# EAGLE design sensor_board (EAGLE 5.11)
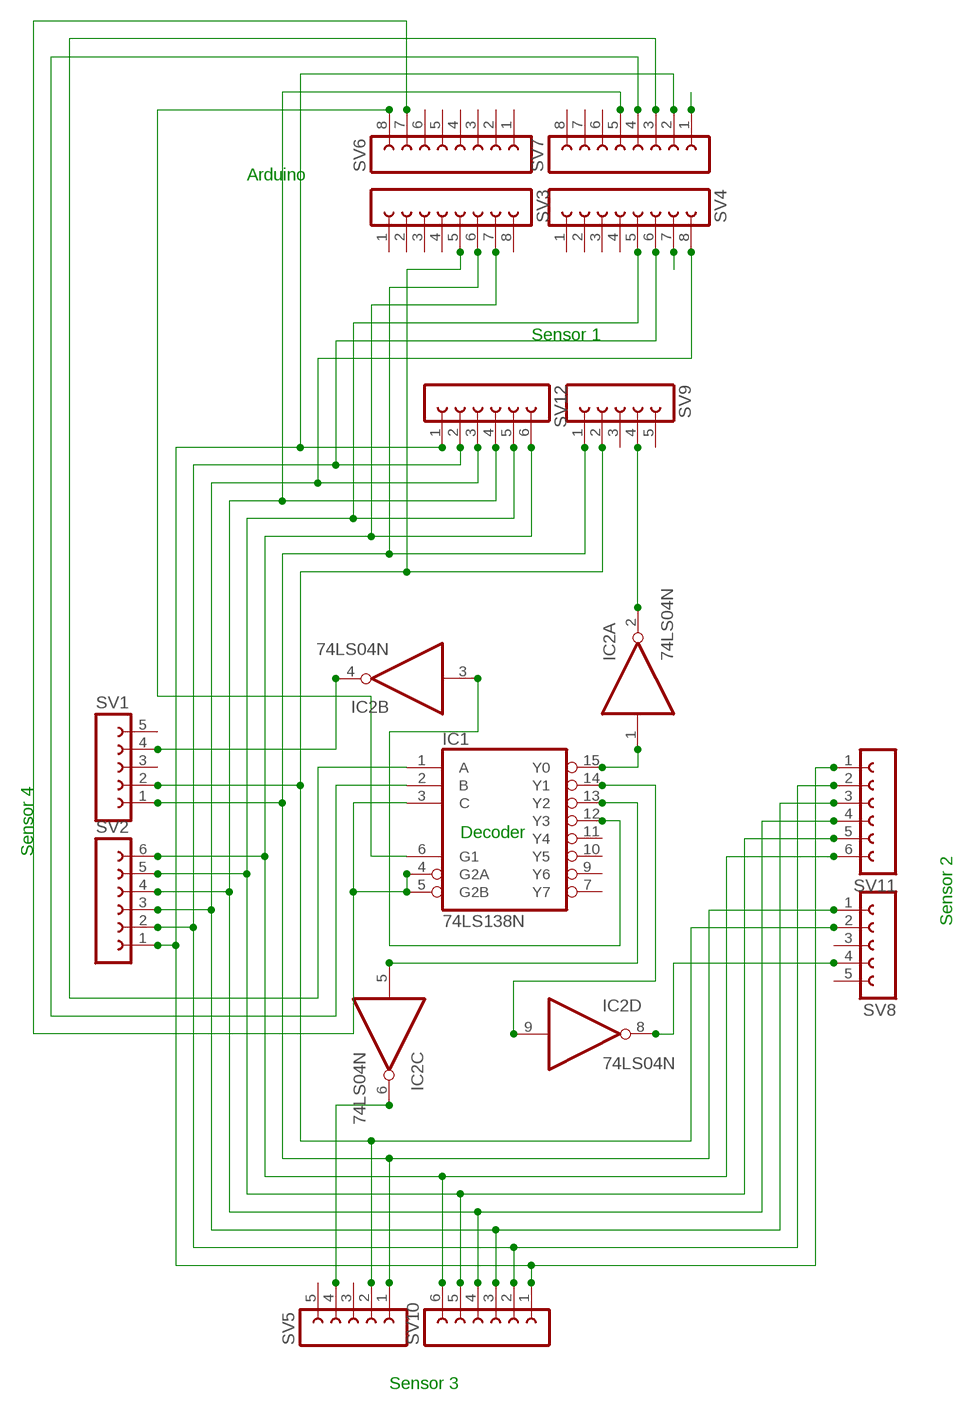
[diagram p0: schematic, sheet 1]

## Parts
IC1  74LS138N  [DIL16]
IC2  74LS04N  [DIL14]
SV1  FE05-1  [FE05-1]
SV2  FE06-1  [FE06]
SV3  FE08-1  [FE08]
SV4  FE08-1  [FE08]
SV5  FE05-1  [FE05-1]
SV6  FE08-1  [FE08]
SV7  FE08-1  [FE08]
SV8  FE05-1  [FE05-1]
SV9  FE05-1  [FE05-1]
SV10  FE06-1  [FE06]
SV11  FE06-1  [FE06]
SV12  FE06-1  [FE06]

## Nets
N$1: SV2.4 SV7.5 SV10.4 SV11.4 SV12.4
N$2: IC1.6(G1) SV6.8
N$9: IC2.4(B:O) SV1.4
N$10: IC2.6(C:O) SV5.4
N$11: IC2.8(D:O) SV8.4
N$12: IC2.2(A:O) SV9.4
N$13: IC1.15(Y0) IC2.1(A:I)
N$14: IC1.14(Y1) IC2.9(D:I)
N$15: IC1.13(Y2) IC2.5(C:I)
N$16: IC1.12(Y3) IC2.3(B:I)
N$17: IC1.3(C) IC1.4(G2A) IC1.5(G2B) SV6.7
N$19: IC1.2(B) SV7.4
N$20: SV1.2 SV3.5 SV5.2 SV8.2 SV9.2
N$21: SV1.1 SV3.6 SV5.1 SV8.1 SV9.1
N$22: SV2.6 SV3.7 SV10.6 SV11.6 SV12.6
N$23: SV2.3 SV4.8 SV10.3 SV11.3 SV12.3
N$24: SV4.7
N$25: SV2.2 SV4.6 SV10.2 SV11.2 SV12.2
N$26: SV2.5 SV4.5 SV10.5 SV11.5 SV12.5
N$27: SV7.1
N$28: SV2.1 SV7.2 SV10.1 SV11.1 SV12.1
N$29: IC1.1(A) SV7.3
Unconnected: IC1.7(Y7) IC1.9(Y6) IC1.10(Y5) IC1.11(Y4) IC2.10(E:O) IC2.11(E:I) IC2.12(F:O) IC2.13(F:I) SV1.3 SV1.5 SV3.1 SV3.2 SV3.3 SV3.4 SV3.8 SV4.1 SV4.2 SV4.3 SV4.4 SV5.3 SV5.5 SV6.1 SV6.2 SV6.3 SV6.4 SV6.5 SV6.6 SV7.6 SV7.7 SV7.8 SV8.3 SV8.5 SV9.3 SV9.5

## Notes on the sheet
- Arduino
- Sensor 1
- Decoder
- Sensor 4 | Sensor 2
- Sensor 3

## Power pins joined to a net without a drawn wire
GND: IC1.8(GND) IC2.7(P:GND)
VCC: IC1.16(VCC) IC2.14(P:VCC)

## Library data of the parts
IC1 = 74xx-us:74*138: 3-line to 8-line DECODER/DEMULTIPLEXER
IC2 = 74xx-us:74*04: Hex INVERTER
SV1 SV5 SV8 SV9 = con-lsta:FE05-1: FEMALE HEADER; OC_FARNELL: unknown; OC_NEWARK: unknown
SV2 SV10-SV12 = con-lsta:FE06-1: FEMALE HEADER; OC_FARNELL: unknown; OC_NEWARK: unknown
SV3 SV4 SV6 SV7 = con-lsta:FE08-1: FEMALE HEADER; OC_FARNELL: unknown; OC_NEWARK: unknown

## Board
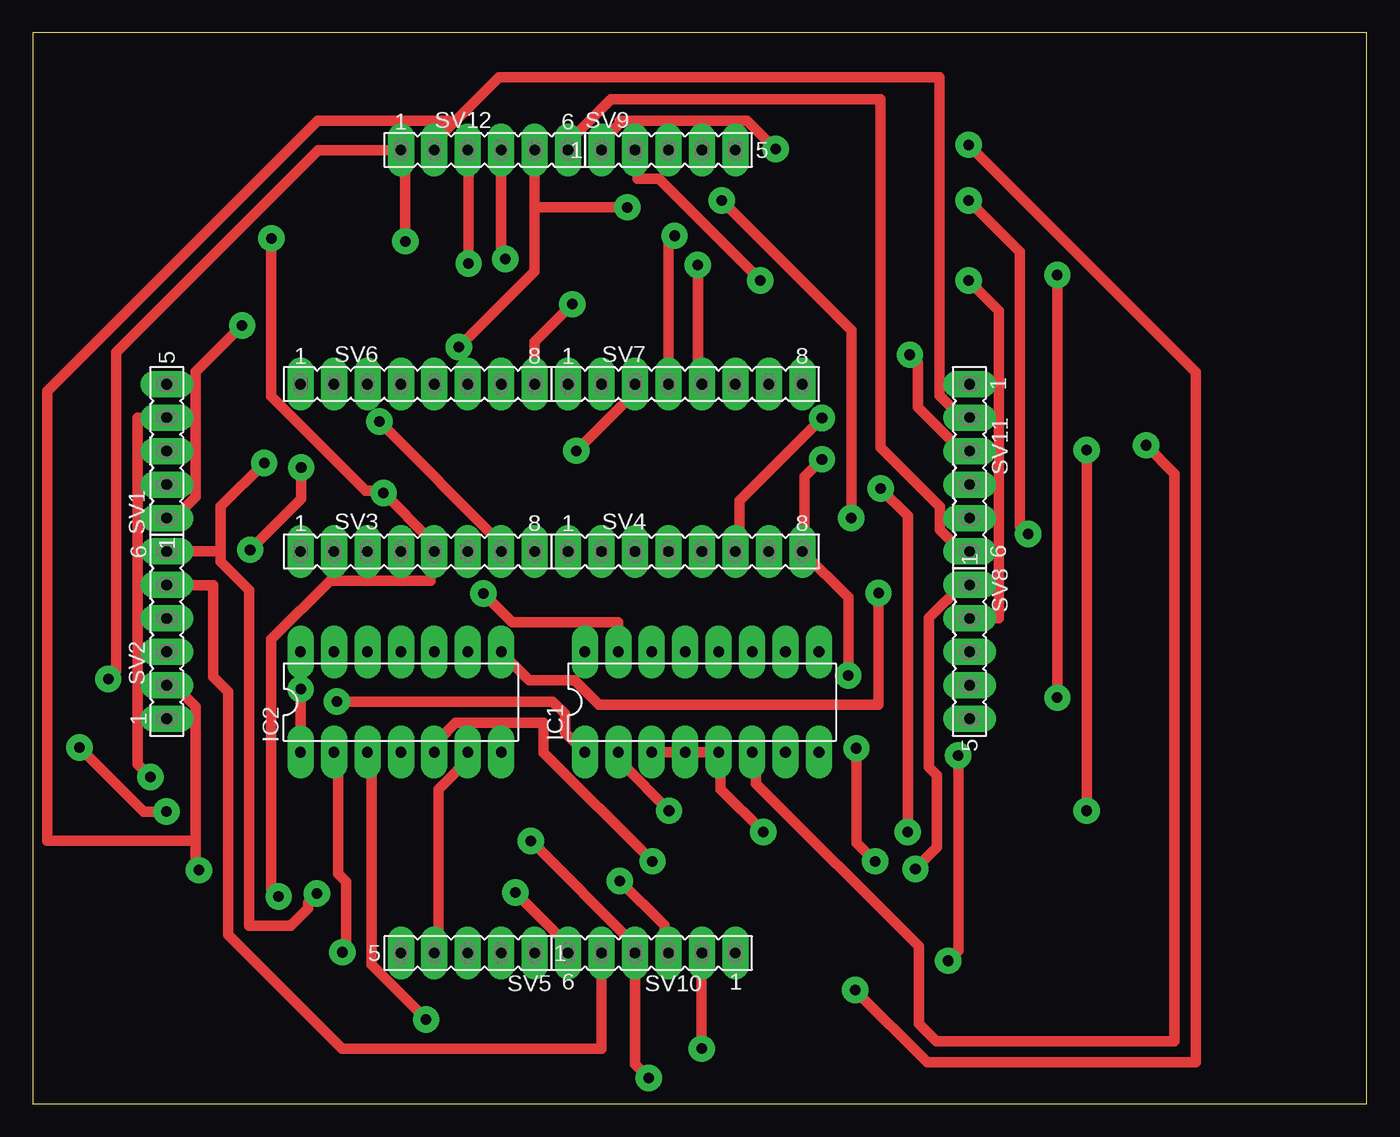
[diagram p1: board, top side]
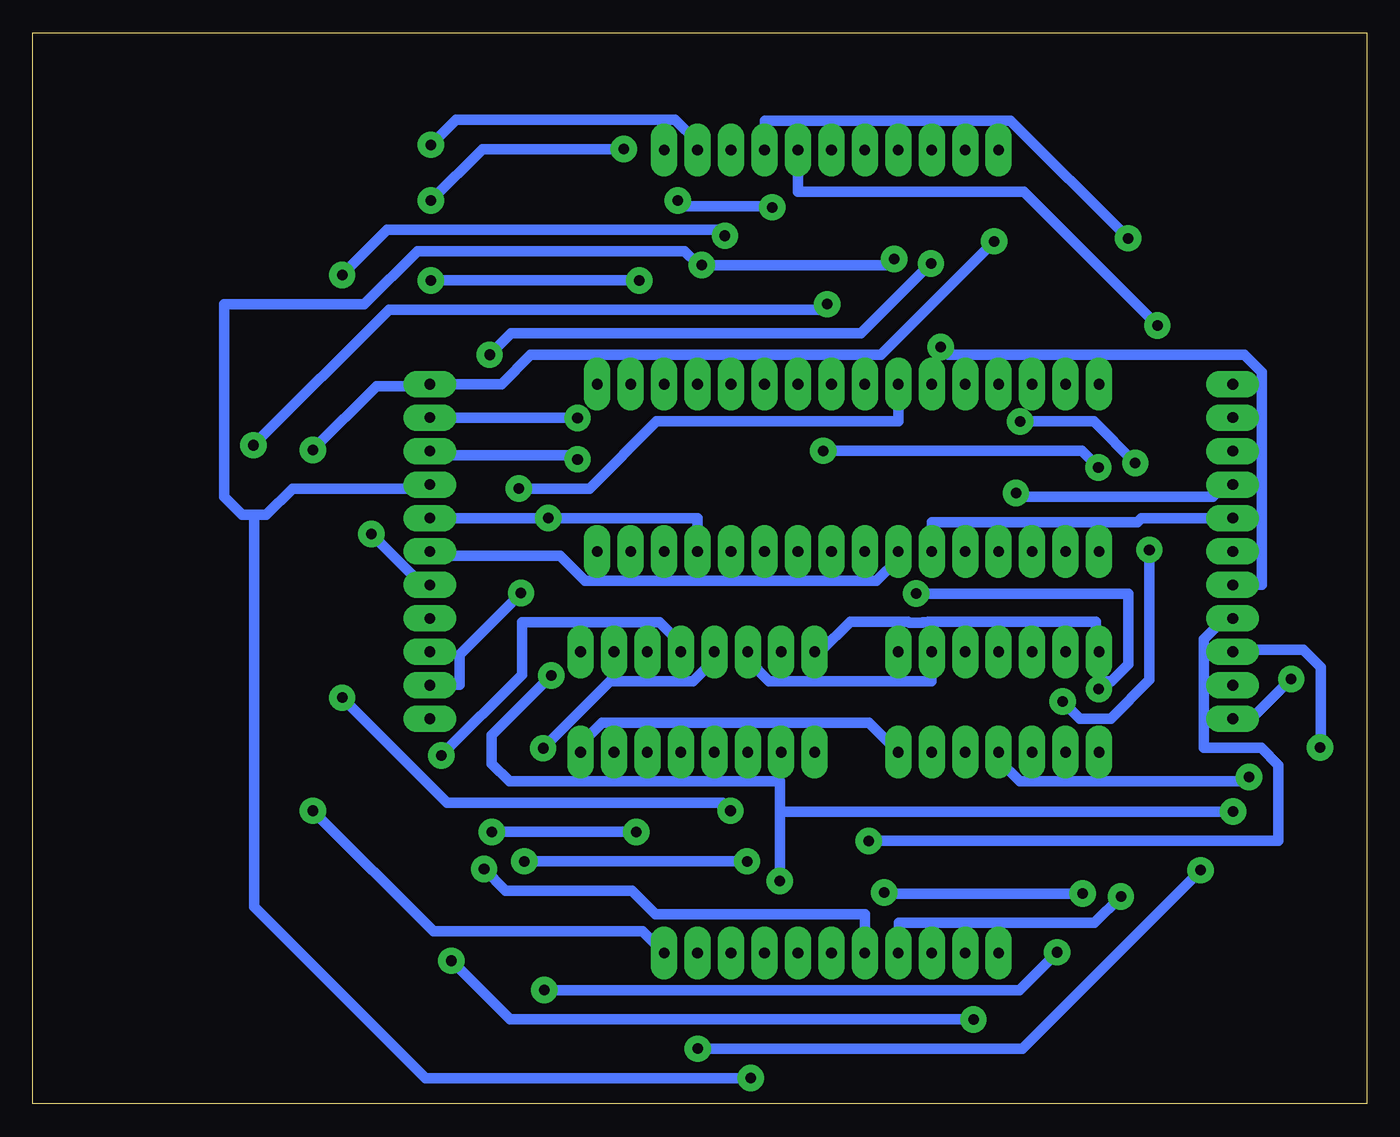
[diagram p2: board, bottom side, seen from below]

Size 101.27 x 81.27 mm. Coordinates in mm from the lower left corner, seen from the top.
Outline: 0,0 101.27,0 101.27,81.27 0,81.27 0,0
Copper layers (1*16): Top 0.035mm / dielectric 1.5mm / Bottom 0.035mm
Design rules "hobby": minimum track width 0.8mm, minimum drill 0.8mm, track to track 0.8mm, track to pad 0.8mm, pad to pad 0.45mm, via to via 0.8mm, smd to smd 8mil, copper to edge 10mil, drill to drill 8mil, minimum pad ring 0.6mm, minimum via ring 0.6mm, stop-mask expansion 0mil, vias tented up to drill 0mil, thermal gap 10mil

### Footprints (pad centres in the part's own frame; a part is rotated, then mirrored left to right if it is on the bottom)
DIL16 = drill 0.813 long: 1 -8.89,-3.81; 2 -6.35,-3.81; 3 -3.81,-3.81; 4 -1.27,-3.81; 5 1.27,-3.81; 6 3.81,-3.81; 7 6.35,-3.81; 8 8.89,-3.81; 9 8.89,3.81; 10 6.35,3.81; 11 3.81,3.81; 12 1.27,3.81; 13 -1.27,3.81; 14 -3.81,3.81; 15 -6.35,3.81; 16 -8.89,3.81
DIL14 = drill 0.813 long: 1 -7.62,-3.81; 2 -5.08,-3.81; 3 -2.54,-3.81; 4 0,-3.81; 5 2.54,-3.81; 6 5.08,-3.81; 7 7.62,-3.81; 8 7.62,3.81; 9 5.08,3.81; 10 2.54,3.81; 11 0,3.81; 12 -2.54,3.81; 13 -5.08,3.81; 14 -7.62,3.81
FE05-1 = drill 0.813 long: 1 -5.08,0; 2 -2.54,0; 3 0,0; 4 2.54,0; 5 5.08,0
FE06 = drill 0.813 long: 1 -6.35,0; 2 -3.81,0; 3 -1.27,0; 4 1.27,0; 5 3.81,0; 6 6.35,0
FE08 = drill 0.813 long: 1 -8.89,0; 2 -6.35,0; 3 -3.81,0; 4 -1.27,0; 5 1.27,0; 6 3.81,0; 7 6.35,0; 8 8.89,0

### Placement (x,y rotation side)
IC1  50.8,30.48 0 top
IC2  27.94,30.48 0 top
SV1  10.16,49.53 90 top
SV2  10.16,35.56 90 top
SV3  29.21,41.91 0 top
SV4  49.53,41.91 0 top
SV5  33.02,11.43 180 top
SV6  29.21,54.61 0 top
SV7  49.53,54.61 0 top
SV8  71.12,34.29 270 top
SV9  48.26,72.39 0 top
SV10  46.99,11.43 180 top
SV11  71.12,48.26 270 top
SV12  34.29,72.39 0 top

### Tracks (layer width: path | path; a pad name or v marks a point on that pad's centre or on a via)
GND
  Bottom 0.8: IC2.7 37.79,28.91 58.04,28.91 59.69,27.26 IC1.8
N$1  (via drill 0.8)
  Top 0.8: v37.82,19.94 45.69,12.07 45.69,11.46 SV10.4 45.72,11.04 45.72,2.97 v46.75,1.94 | v50.5,63.65 50.5,54.91 50.79,54.62 SV7.5 | v35.88,64.1 35.56,64.42 35.56,72.36 SV12.4
  Bottom 0.8: v37.82,19.94 6.69,19.94 6.69,25.68 8.01,27 12.37,27 12.37,35.23 11.08,36.52 10.46,36.52 10.17,36.81 SV2.4 | v35.88,64.1 36.34,63.65 v50.5,63.65 50.88,63.81 51.79,64.71 72.08,64.71 76.11,60.68 86.75,60.68 86.75,46.07 85.37,44.68 84.46,44.68 | 84.46,44.68 83.56,44.68 81.56,46.68 71.43,46.68 71.14,46.97 SV11.4 | v46.75,1.94 71.46,1.94 84.46,14.94 84.46,44.68
N$2  (via drill 0.8)
  Top 0.8: v84.53,49.97 86.69,47.81 86.69,4.75 68.59,4.75 67.27,6.07 67.27,11.94 54.92,24.29 54.92,26.36 54.62,26.65 IC1.6 | v40.95,60.68 38.11,57.84 SV6.8
  Bottom 0.8: v84.53,49.97 74.24,60.26 41.37,60.26 v40.95,60.68
N$9  (via drill 0.8)
  Top 0.8: v8.91,24.78 7.95,25.75 7.95,52.07 10.14,52.07 SV1.4
  Bottom 0.8: v8.91,24.78 9.24,24.45 26.33,24.45 27.91,26.04 27.91,26.65 IC2.4
N$10
  Top 0.8: SV5.4 30.5,11.46 30.79,11.75 30.79,23.84 33.01,26.07 33.01,26.65 IC2.6
N$11  (via drill 0.8)
  Top 0.8: v64.2,38.75 64.2,30.26 42.98,30.26 41.11,32.13 37.69,32.13 35.56,34.26 IC2.8
  Bottom 0.8: v64.2,38.75 68.88,34.07 68.88,31.78 71.11,31.78 SV8.4
N$12  (via drill 0.8)
  Top 0.8: v23.5,11.49 23.79,11.78 23.79,16.84 23.17,17.45 23.17,26.36 22.88,26.65 IC2.2 | v62.43,8.62 67.91,3.13 88.3,3.13 88.3,55.52 v71.04,72.78
  Bottom 0.8: v23.5,11.49 26.37,8.62 v62.43,8.62 | v71.04,72.78 69.14,74.68 52.5,74.68 50.82,73 50.82,72.39 SV9.4
N$13  (via drill 0.8)
  Top 0.8: v20.33,31.45 20.33,26.68 IC2.1 | v34.21,38.71 36.4,36.52 44.43,36.52 44.43,34.29 IC1.15
  Bottom 0.8: v20.33,31.45 19.72,32.07 19.4,32.07 18.11,33.36 18.11,38.71 v34.21,38.71
N$14
  Bottom 0.8: IC2.9 33.04,34.26 33.04,32.07 45.37,32.07 46.98,33.68 46.98,34.26 IC1.14
N$15  (via drill 0.8)
  Top 0.8: v47.04,18.39 38.79,26.65 38.79,28.91 32.11,28.91 30.79,27.58 30.79,26.97 30.5,26.68 IC2.5 | v63.95,18.39 62.53,19.81 v62.53,26.97
  Bottom 0.8: v47.04,18.39 v63.95,18.39 | v62.53,26.97 57.43,32.07 51.14,32.07 49.56,33.65 49.56,34.26 IC1.13
N$16  (via drill 0.8)
  Top 0.8: v29.85,6.39 25.72,10.52 25.72,26.36 25.43,26.65 IC2.3 | v69.5,10.84 70.27,11.62 v70.27,26.42
  Bottom 0.8: v29.85,6.39 65.04,6.39 v69.5,10.84 | v70.27,26.42 64.14,32.55 64.14,36.52 53.69,36.52 52.08,34.91 IC1.12
N$17  (via drill 0.8)
  Top 0.8: IC1.3 47.01,26.68 IC1.4 49.92,26.68 52.04,26.68 IC1.5 52.21,26.29 52.21,23.87 v55.46,20.62 | v64.37,46.68 66.43,44.62 v66.43,20.62
  Bottom 0.8: v64.37,46.68 59.01,46.68 53.92,51.78 35.56,51.78 35.56,54.58 SV6.7 | v55.46,20.62 v66.43,20.62
N$19  (via drill 0.8)
  Top 0.8: v48.3,22.23 44.75,25.78 44.75,26.36 44.46,26.65 IC1.2 | v77.79,30.81 v77.79,62.91 | v48.72,65.88 48.27,65.42 SV7.4
  Bottom 0.8: v48.3,22.23 48.92,22.84 69.82,22.84 v77.79,30.81 | v77.79,62.91 74.37,66.33 49.17,66.33 v48.72,65.88
N$20  (via drill 0.8)
  Top 0.8: v18.66,15.71 18.11,16.26 18.11,35.23 22.56,39.68 30.21,39.68 30.21,41.58 SV3.5 30.46,41.94 30.17,42.23 30.17,42.81 v26.62,46.36 26.24,46.52 25.27,46.52 18.11,53.68 v18.11,65.68 | v71.04,62.49 73.33,60.2 73.33,36.84 71.14,36.84 SV8.2 | v55.24,62.49 47.53,70.2 45.92,70.2 45.92,72.17 45.72,72.36 SV9.2
  Bottom 0.8: v26.62,46.36 26.33,46.07 11.69,46.07 10.79,46.97 10.17,46.97 SV1.2 | v18.66,15.71 20.66,13.71 35.53,13.71 35.53,11.46 SV5.2 | v18.11,65.68 27.04,74.62 45.69,74.62 45.69,72.39 SV9.2 | v55.24,62.49 v71.04,62.49
N$21  (via drill 0.8)
  Top 0.8: v67.01,17.81 68.66,19.45 68.66,24.91 68.04,25.52 68.04,36.88 70.53,39.36 71.11,39.36 SV8.1 | v15.88,59.07 12.37,55.55 12.37,46.07 10.75,44.46 10.17,44.46 SV1.1 | v75.56,43.23 74.95,43.84 74.95,64.65 v71.04,68.55 | v56.4,72.45 54.24,74.62 44.56,74.62 44.56,74.36 43.21,73 43.21,72.39 SV9.1
  Bottom 0.8: v67.01,17.81 65.37,16.16 55.79,16.16 54.01,14.39 38.11,14.39 38.11,11.46 SV5.1 | SV3.6 33.01,41.94 33.01,44.13 17.4,44.13 17.11,44.42 10.17,44.42 SV1.1 | v15.88,59.07 26.01,69.2 43.17,69.2 43.17,72.36 SV9.1 | v75.56,43.23 72.01,39.68 71.43,39.68 71.14,39.39 SV8.1 | v71.04,68.55 67.14,72.45 v56.4,72.45
N$22  (via drill 0.8)
  Top 0.8: 14.27,41.94 10.17,41.94 SV2.6 | 14.27,41.94 14.27,45.33 v17.56,48.62 | v26.3,51.78 35.53,42.55 35.53,41.94 SV3.7 | v36.62,16.04 40.34,12.33 40.34,11.75 40.62,11.46 SV10.6 | v21.56,15.94 20.88,15.26 20.88,14.81 19.56,13.49 16.43,13.49 16.43,38.97 14.27,41.13 14.27,41.94 | SV12.6 40.66,72.39 40.95,72.68 40.95,73.29 43.88,76.23 64.37,76.23 64.37,49.81 68.88,45.29 68.88,43.55 70.5,41.94 71.11,41.94 SV11.6
  Bottom 0.8: v17.56,48.62 20.72,51.78 v26.3,51.78 | v36.62,16.04 36.53,15.94 v21.56,15.94 | SV11.6 71.11,41.91 70.79,41.58 61.24,41.58 59.33,39.68 37.21,39.68 35.56,41.33 SV3.7
N$23  (via drill 0.8)
  Top 0.8: v33.08,63.78 33.08,72.33 33.04,72.36 SV12.3 | v66.59,56.84 67.2,56.23 67.2,52.84 70.5,49.55 71.11,49.55 SV11.3 | v44.56,16.91 47.95,13.52 47.95,11.75 48.24,11.46 SV10.3 | v61.92,32.49 61.92,38.42 58.43,41.91 SV4.8 58.59,42.29 58.59,47.58 v59.92,48.91 | v3.53,27.04 8.4,22.16 v10.14,22.16
  Bottom 0.8: v33.08,63.78 38.4,58.46 64.98,58.46 v66.59,56.84 | 44.56,22.16 44.56,24.45 65.08,24.45 66.43,25.81 66.43,27.97 v61.92,32.49 | 44.56,22.16 v44.56,16.91 | v3.53,27.04 3.5,27.04 3.5,33.13 4.82,34.45 9.98,34.45 10.14,34.29 SV2.3 | v10.14,22.16 44.56,22.16 | v59.92,48.91 60.21,49.2 70.79,49.2 71.11,49.52 SV11.3
N$25  (via drill 0.8)
  Top 0.8: v50.79,4.17 50.79,11.42 SV10.2 | v12.59,17.71 12.37,17.94 12.37,19.94 | 12.37,19.94 12.37,30.13 10.75,31.75 10.17,31.75 SV2.2 | v59.92,52.04 53.66,45.78 53.66,42.23 53.37,41.94 SV4.6 | 31.83,74.34 35.4,77.91 68.82,77.91 68.82,53.78 70.5,52.1 71.11,52.1 SV11.2 | 31.83,74.34 30.79,73.29 30.79,72.68 30.5,72.39 SV12.2 | 12.37,19.94 1.08,19.94 1.08,54.07 21.62,74.62 31.56,74.62 31.83,74.34
  Bottom 0.8: v50.79,4.17 26.14,4.17 v12.59,17.71 | v59.92,52.04 59.95,52.07 71.11,52.07 SV11.2
N$26  (via drill 0.8)
  Top 0.8: SV2.5 10.17,39.36 13.69,39.36 13.69,32.39 14.82,31.26 14.82,12.81 23.46,4.17 43.17,4.17 SV10.5 | 38.11,68.04 38.11,63.2 v32.33,57.42 | 38.11,68.04 38.11,72.36 SV12.5 | v62.14,44.46 62.14,58.71 v52.3,68.55 | 38.11,68.04 v45.14,68.04
  Bottom 0.8: 62.14,44.42 71.11,44.42 SV11.5 | 62.14,44.42 50.82,44.42 50.82,41.94 SV4.5 | v32.33,57.42 31.75,56.84 9.27,56.84 7.95,55.52 7.95,39.39 10.14,39.39 SV2.5 | v52.3,68.55 51.85,68.1 45.21,68.1 v45.14,68.04 | v62.14,44.46 62.14,44.42
N$28  (via drill 0.8)
  Top 0.8: v5.72,32.23 6.33,32.84 6.33,57.04 21.66,72.36 27.91,72.36 SV12.1 28.08,71.97 28.27,71.78 v28.27,65.45 | v80.01,49.62 v80.01,22.23
  Bottom 0.8: v5.72,32.23 8.43,29.52 9.85,29.52 10.14,29.23 SV2.1 | 43.21,56.84 43.21,54.62 SV7.2 | 43.21,56.84 63.46,56.84 65.69,54.62 71.11,54.62 SV11.1 71.5,54.46 75.17,54.46 v80.01,49.62 | v80.01,22.23 70.85,13.07 54.98,13.07 53.37,11.46 SV10.1 | v28.27,65.45 36.88,56.84 43.21,56.84
N$29  (via drill 0.8)
  Top 0.8: v23.08,30.52 39.46,30.52 40.4,29.58 40.4,28.16 41.88,26.68 IC1.1 | v16.5,42.04 20.37,45.91 v20.37,48.29 | v41.27,49.55 45.69,53.97 45.69,54.58 SV7.3
  Bottom 0.8: v23.08,30.52 21.79,29.23 19.43,29.23 16.5,32.16 v16.5,42.04 | v20.37,48.29 21.62,49.55 v41.27,49.55
VCC
  Bottom 0.8: IC2.14 20.33,34.29 20.56,34.52 20.56,36.58 33.27,36.58 33.34,36.52 33.69,36.52 33.72,36.49 34.72,36.49 34.82,36.58 39.21,36.58 41.5,34.29 41.88,34.29 IC1.16